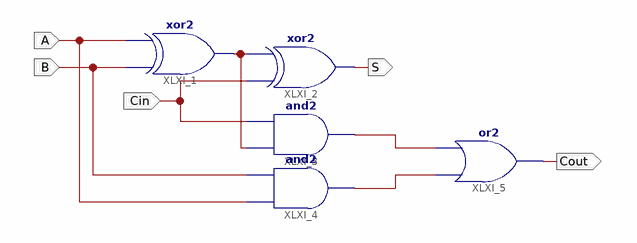
[diagram p0: schematic sheet 1]
// Xilinx ISE schematic Fulladder.sch (spartan6) as structural Verilog: 5 symbols, 5 ports
module Fulladder (
  input  B,
  input  A,
  input  Cin,
  output S,
  output Cout
);

  wire XLXN_2, XLXN_3, XLXN_8;

  xor XLXI_1 (XLXN_8, B, A);
  xor XLXI_2 (S, Cin, XLXN_8);
  and XLXI_3 (XLXN_2, XLXN_8, Cin);
  and XLXI_4 (XLXN_3, A, B);
  or XLXI_5 (Cout, XLXN_3, XLXN_2);
endmodule
